# EAGLE schematic BonkSwitch (EAGLE 7.7.0)
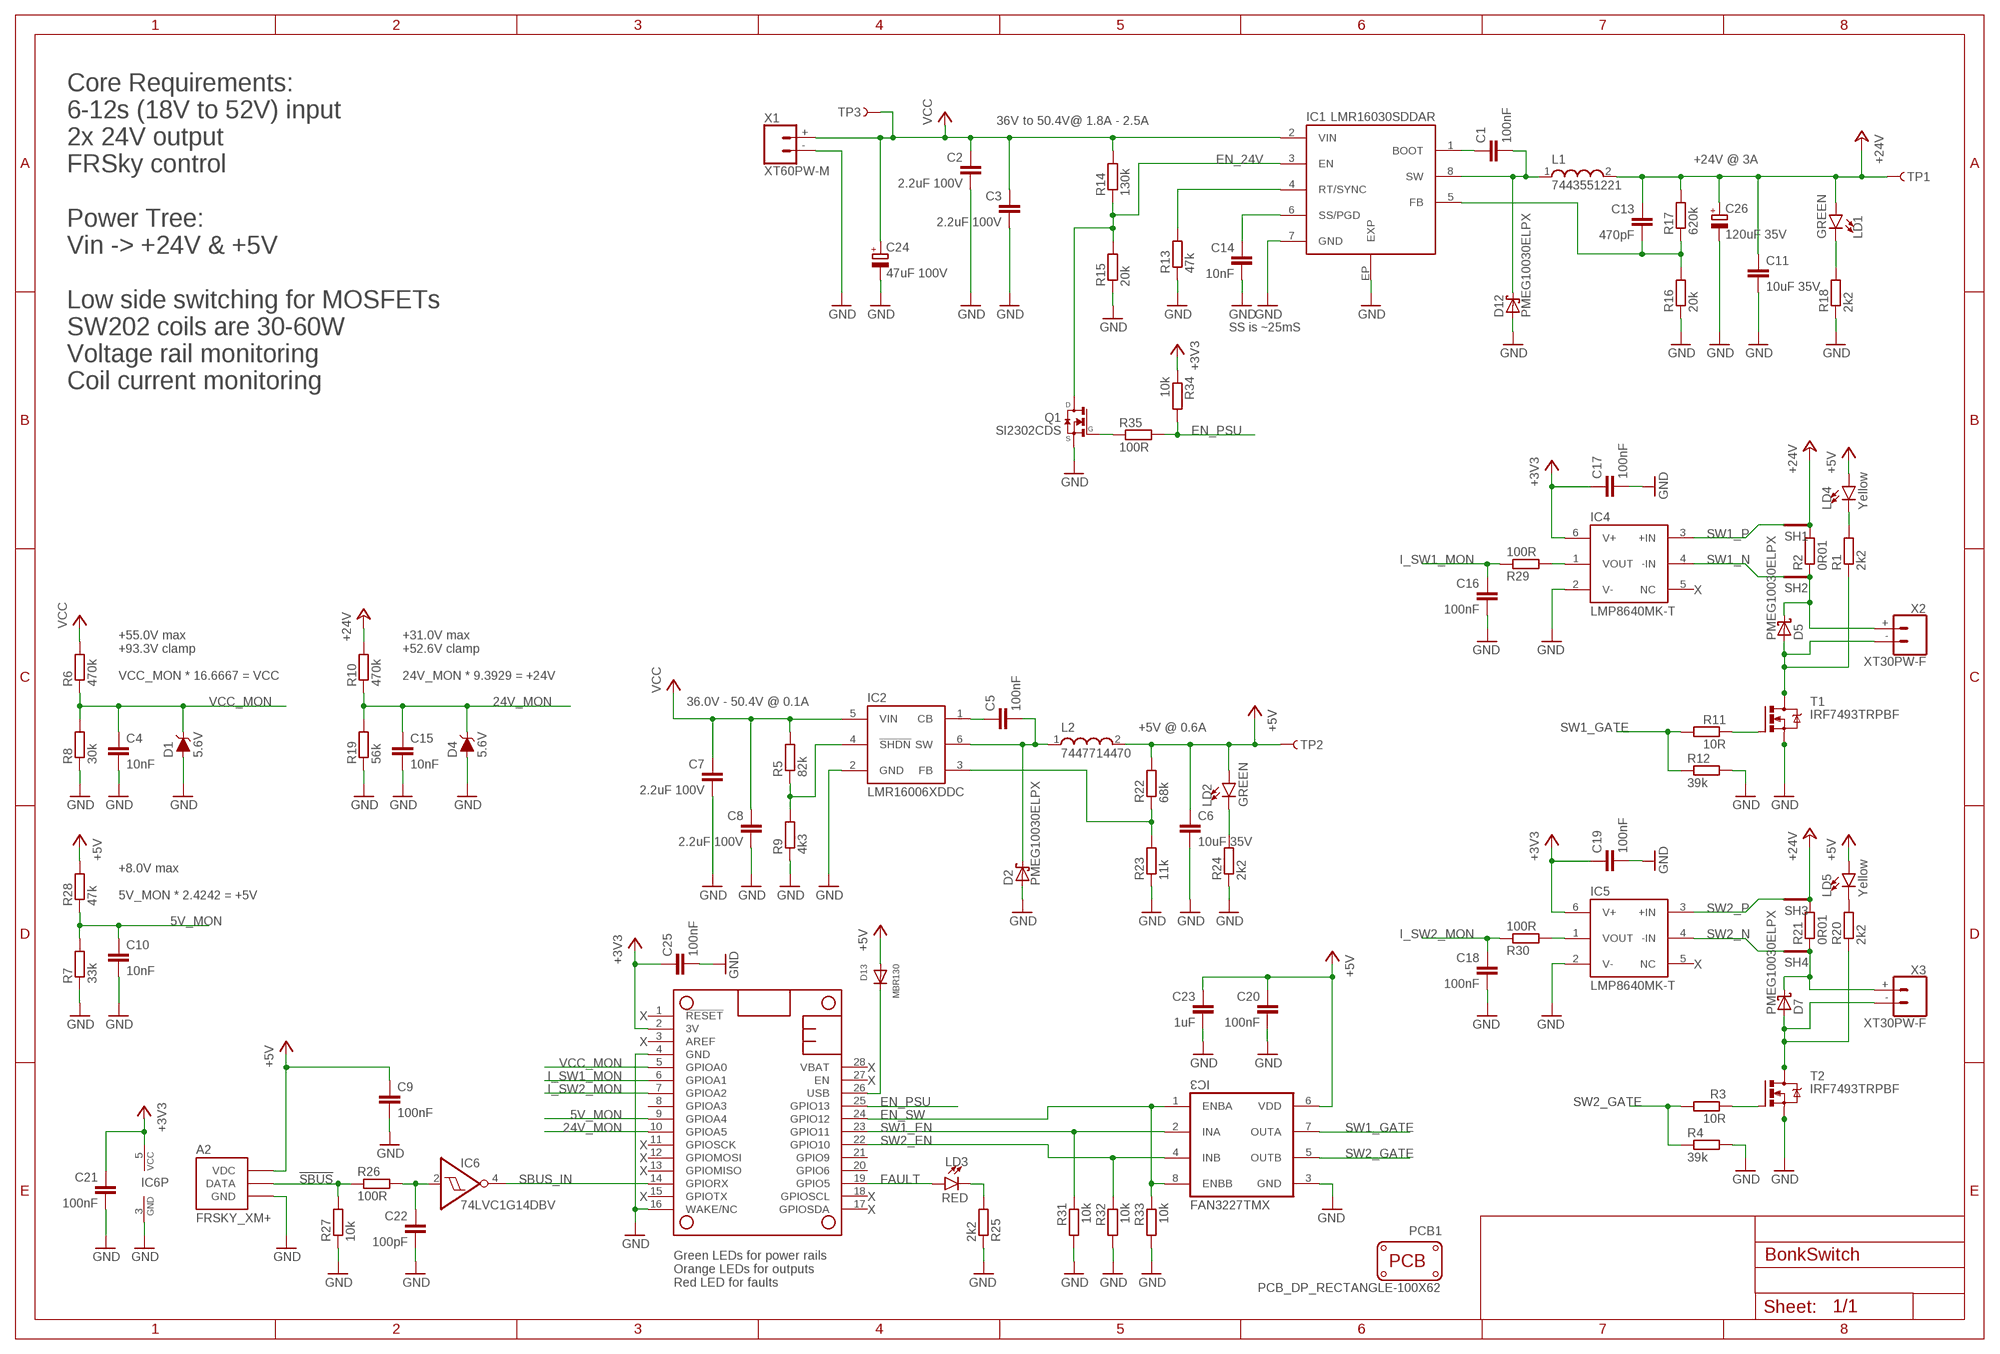
[diagram p0: schematic, sheet 1]

## Parts
A1  FEATHERWING_NODIM  [FEATHERWING_DIM]
A2  FRSKY_XM+  [FRSKY_XM+]
C1  100nF  C-EUC0603  [C0603]
C2  2.2uF 100V  C-EUC1210  [C1210]
C3  2.2uF 100V  C-EUC1210  [C1210]
C4  10nF  C-EUC0603  [C0603]
C5  100nF  C-EUC0603  [C0603]
C6  10uF 35V  C-EUC1210  [C1210]
C7  2.2uF 100V  C-EUC1210  [C1210]
C8  2.2uF 100V  C-EUC1210  [C1210]
C9  100nF  C-EUC0603  [C0603]
C10  10nF  C-EUC0603  [C0603]
C11  10uF 35V  C-EUC1210  [C1210]
C13  470pF  C-EUC0603  [C0603]
C14  10nF  C-EUC0603  [C0603]
C15  10nF  C-EUC0603  [C0603]
C16  100nF  C-EUC0603  [C0603]
C17  100nF  C-EUC0603  [C0603]
C18  100nF  C-EUC0603  [C0603]
C19  100nF  C-EUC0603  [C0603]
C20  100nF  C-EUC0603  [C0603]
C21  100nF  C-EUC0603  [C0603]
C22  100pF  C-EUC0603  [C0603]
C23  1uF  C-EUC0805  [C0805]
C24  47uF 100V  CPOL-EUUD-10X10  [UD-10X10_NICHICON]
C25  100nF  C-EUC0603  [C0603]
C26  120uF 35V  CPOL-EUE  [PANASONIC_E]
D1  5.6V  DIODE-ZENER-MMSZ5232BS  [SOD-323]
D2  PMEG10030ELPX  SCHOTTKY-DIODESOD128  [SOD128]
D4  5.6V  DIODE-ZENER-MMSZ5232BS  [SOD-323]
D5  PMEG10030ELPX  SCHOTTKY-DIODESOD128  [SOD128]
D7  PMEG10030ELPX  SCHOTTKY-DIODESOD128  [SOD128]
D12  PMEG10030ELPX  SCHOTTKY-DIODESOD128  [SOD128]
D13  MBR130  DIODESOD-123  [SOD-123]
IC1  LMR16030SDDAR  LMR16030  [HSOIC8]
IC2  LMR16006XDDC  LMR16006  [SOT23-6]
IC3  FAN3227TMX  UCC27424D  [SOIC127P600X175-8N]
IC4  LMP8640MK-T  LMP8640  [SOT23-6]
IC5  LMP8640MK-T  LMP8640  [SOT23-6]
IC6  74LVC1G14DBV  74AHC1G14DBV  [SOT23-5]
L1  7443551221  WE-HCI_1350/1365  [WE-HCI_1350/1365]
L2  7447714470  WE-PD_1030/1050  [WE-PD_1030/1050]
LD1  GREEN  LED-GREEN0603  [LED-0603]
LD2  GREEN  LED-GREEN0603  [LED-0603]
LD3  RED  LED-RED0603  [LED-0603]
LD4  Yellow  LED-YELLOW0603  [LED-0603]
LD5  Yellow  LED-YELLOW0603  [LED-0603]
PCB1  PCB_DP_RECTANGLE-100X62  [DP10062_V1]
Q1  SI2302CDS  SI2302  [SOT23]
R1  2k2  R-EU_R0603  [R0603]
R2  0R01  R-EU_R2512  [R2512]
R3  10R  R-EU_R0805  [R0805]
R4  39k  R-EU_R0805  [R0805]
R5  82k  R-EU_R0603  [R0603]
R6  470k  R-EU_R0603  [R0603]
R7  33k  R-EU_R0603  [R0603]
R8  30k  R-EU_R0603  [R0603]
R9  4k3  R-EU_R0603  [R0603]
R10  470k  R-EU_R0603  [R0603]
R11  10R  R-EU_R0805  [R0805]
R12  39k  R-EU_R0805  [R0805]
R13  47k  R-EU_R0603  [R0603]
R14  130k  R-EU_R0603  [R0603]
R15  20k  R-EU_R0603  [R0603]
R16  20k  R-EU_R0603  [R0603]
R17  620k  R-EU_R0603  [R0603]
R18  2k2  R-EU_R0805  [R0805]
R19  56k  R-EU_R0603  [R0603]
R20  2k2  R-EU_R0603  [R0603]
R21  0R01  R-EU_R2512  [R2512]
R22  68k  R-EU_R0603  [R0603]
R23  11k  R-EU_R0603  [R0603]
R24  2k2  R-EU_R0603  [R0603]
R25  2k2  R-EU_R0603  [R0603]
R26  100R  R-EU_R0603  [R0603]
R27  10k  R-EU_R0603  [R0603]
R28  47k  R-EU_R0603  [R0603]
R29  100R  R-EU_R0603  [R0603]
R30  100R  R-EU_R0603  [R0603]
R31  10k  R-EU_R0603  [R0603]
R32  10k  R-EU_R0603  [R0603]
R33  10k  R-EU_R0603  [R0603]
R34  10k  R-EU_R0603  [R0603]
R35  100R  R-EU_R0603  [R0603]
SH1  SHORTT1  [SHORT_TOP-01]
SH2  SHORTT1  [SHORT_TOP-01]
SH3  SHORTT1  [SHORT_TOP-01]
SH4  SHORTT1  [SHORT_TOP-01]
T1  IRF7493TRPBF  N-MOSFET-SO8S  [SO-08]
T2  IRF7493TRPBF  N-MOSFET-SO8S  [SO-08]
TP1  TESTPOINT_1.5X1.5  [TESTPAD_1.5X1.5]
TP2  TESTPOINT_1.5X1.5  [TESTPAD_1.5X1.5]
TP3  TESTPOINT_1.5X1.5  [TESTPAD_1.5X1.5]
X1  XT60PW-M  [XT60PW-M]
X2  XT30PW-F  [XT30PW-F]
X3  XT30PW-F  [XT30PW-F]

## Nets
5V_MON: A1.9(GPIOA4) C10.1 R7.2 R28.1
24V_MON: A1.10(GPIOA5) C15.1 D4.C R10.1 R19.2
!SBUS: A2.3(DATA) R26.1 R27.2
!SBUS_FILT: C22.1 IC6.2(I) R26.2
+3V3: A1.2(3V) C17.1 C19.1 C21.1 C25.1 IC4.6(V+) IC5.6(V+) IC6.5(VCC) R34.1
+5V: A2.2(VDC) C6.1 C9.1 C20.1 C23.1 D13.A IC3.6(VDD) L2.2 LD2.A LD4.A LD5.A R22.2 R28.2 TP2.1
+24V [power]: C11.1 C13.1 C26.+ L1.2 LD1.A R2.2 R10.2 R17.2 R21.2 SH1.1 SH3.1 TP1.1
BST_5V: C5.1 IC2.1(CB)
BST_24V: C1.1 IC1.1(BOOT)
EN_5V: IC2.4(!SHDN!) R5.1 R9.2
EN_24V: IC1.3(EN) Q1.3(D) R14.1 R15.2
EN_PSU: A1.25(GPIO13) R34.2 R35.2
EN_SW: A1.24(GPIO12) IC3.1(ENBA) IC3.8(ENBB) R33.1
FAULT: A1.19(GPIO5) LD3.A
FB_5V: IC2.3(FB) R22.1 R23.2
FB_24V: C13.2 IC1.5(FB) R16.2 R17.1
GND: A1.4(GND) A1.16(WAKE/NC) A2.1(GND) C2.2 C3.2 C4.2 C6.2 C7.2 C8.2 C9.2 C10.2 C11.2 C14.2 C15.2 C16.2 C17.2 C18.2 C19.2 C20.2 C21.2 C22.2 C23.2 C24.- C25.2 C26.- D1.A D2.A D4.A D12.A IC1.7(GND) IC1.EP(EXP) IC2.2(GND) IC3.3(GND) IC4.2(V-) IC5.2(V-) IC6.3(GND) Q1.2(S) R4.2 R7.1 R8.1 R9.1 R12.2 R13.1 R15.1 R16.1 R18.1 R19.1 R23.1 R24.1 R25.1 R27.1 R31.2 R32.2 R33.2 T1.1(S) T1.2(S) T1.3(S) T2.1(S) T2.2(S) T2.3(S) X1.-
I_SW1: IC4.1(VOUT) R29.2
I_SW1_MON: A1.6(GPIOA1) C16.1 R29.1
I_SW2: IC5.1(VOUT) R30.2
I_SW2_MON: A1.7(GPIOA2) C18.1 R30.1
N$1 [power]: D7.C R21.1 SH4.1 X3.+
N$2: Q1.1(G) R35.1
N$3: R11.1 T1.4(G)
N$4 [power]: D5.A R1.1 T1.5(D) T1.6(D) T1.7(D) T1.8(D) X2.-
N$6: LD4.C R1.2
N$9: R3.1 T2.4(G)
N$10 [power]: D7.A R20.1 T2.5(D) T2.6(D) T2.7(D) T2.8(D) X3.-
N$11: LD5.C R20.2
N$12 [power]: D5.C R2.1 SH2.1 X2.+
N$13: LD3.C R25.2
N$14: LD1.C R18.2
N$19: LD2.C R24.2
RT_24V: IC1.4(RT/SYNC) R13.2
SBUS_IN: A1.14(GPIORX) IC6.4(O)
SS_24V: C14.1 IC1.6(SS/PGD)
SW1_EN: A1.23(GPIO11) IC3.2(INA) R31.1
SW1_GATE: IC3.7(OUTA) R11.2 R12.1
SW1_N: IC4.4(-IN) SH2.2
SW1_P: IC4.3(+IN) SH1.2
SW2_EN: A1.22(GPIO10) IC3.4(INB) R32.1
SW2_GATE: IC3.5(OUTB) R3.2 R4.1
SW2_N: IC5.4(-IN) SH4.2
SW2_P: IC5.3(+IN) SH3.2
SW_5V: C5.2 D2.C IC2.6(SW) L2.1
SW_24V [power]: C1.2 D12.C IC1.8(SW) L1.1
V_USB: A1.26(USB) D13.C
VCC [power]: C2.1 C3.1 C7.1 C8.1 C24.+ IC1.2(VIN) IC2.5(VIN) R5.2 R6.2 R14.2 TP3.1 X1.+
VCC_MON: A1.5(GPIOA0) C4.1 D1.C R6.1 R8.2
Unconnected: A1.1(!RESET) A1.3(AREF) A1.8(GPIOA3) A1.11(GPIOSCK) A1.12(GPIOMOSI) A1.13(GPIOMISO) A1.15(GPIOTX) A1.17(GPIOSDA) A1.18(GPIOSCL) A1.20(GPIO6) A1.21(GPIO9) A1.27(EN) A1.28(VBAT) IC4.5(NC) IC5.5(NC)

## Notes on the sheet
- Core Requirements:
  6-12s (18V to 52V) input
  2x 24V output
  FRSky control
  
  Power Tree:
  Vin -> +24V & +5V
  
  Low side switching for MOSFETs
  SW202 coils are 30-60W
  Voltage rail monitoring
  Coil current monitoring
- 36V to 50.4V@ 1.8A - 2.5A
- +24V @ 3A
- SS is ~25mS
- X
- +55.0V max
  +93.3V clamp
  
  VCC_MON * 16.6667 = VCC
- +31.0V max
  +52.6V clamp
  
  24V_MON * 9.3929 = +24V
- 36.0V - 50.4V @ 0.1A
- +5V @ 0.6A
- +8.0V max
  
  5V_MON * 2.4242 = +5V
- X
- X
- X
- X
- X
- X
- X
- X
- X | X
- X
- Green LEDs for power rails
  Orange LEDs for outputs
  Red LED for faults

## Library data of the parts
A1 = ThingySticks:FEATHERWING; OC_FARNELL: unknown
A2 = general:FRSKY_XM+; OC_FARNELL: unknown
C1 C4 C5 C9 C10 C13-C23 C25 = rcl:C-EU: CAPACITOR, European symbol; OC_FARNELL: unknown
C2 C3 C7 C8 = rcl:C-EU: CAPACITOR, European symbol; MF: TDK; MPN: C3225X7R2A225K230AB; OC_FARNELL: 2112727; OC_RS: 766-1211
C6 C11 = rcl:C-EU: CAPACITOR, European symbol; MF: TAIYO YUDEN; MPN: GMK325AB7106MM-T; OC_FARNELL: 2309017; OC_RS: 766-1194
C24 = rcl:CPOL-EU: POLARIZED CAPACITOR, European symbol; MF: PANASONIC; MPN: EEEHA2A470UP; OC_FARNELL: 1973389; OC_RS: 739-3116
C26 = rcl:CPOL-EU: POLARIZED CAPACITOR, European symbol; MF: PANASONIC; MPN: 35SVPF120M; OC_FARNELL: 2354806; OC_RS: 795-5348
D1 D4 = SparkFun-DiscreteSemi:DIODE-ZENER: Zener Diode A Zener diode allows current to flow from its anode to its cathode like a normal semiconductor diode, but it also permits current to flow in the reverse direction when its "Zener voltage" is reached. - WIkipedia; MF: ON SEMICONDUCTOR; MPN: MM3Z4V3ST1G; OC_FARNELL: 2844819; OC_RS: 802-4625; PROD_ID: DIO-12442
D2 D5 D7 D12 = diode:SCHOTTKY-DIODE: Schottky Diode; MF: NEXPERIA; MPN: PMEG10030ELPX; OC_FARNELL: 2498548
D13 = microbuilder:DIODE: Diode SMADIODE - SMA Surface Mount Package 20V 1A Schottky Diode Digikey (500mV @ 1A, 500uA Vr @ 20V): 641-1014-6-ND 10V 2A Schottky Diode Digikey (350mV @ 2A, 700uA Vr @ 10V): MBRA210LT3 SOD-123 30V 200mA (800mV Vf, 2uA Vr @ 25V) Schottky Diode (very fast switching for boost, etc.) - Digikey: BAT54T1GOSTR-ND 30V 500mA (430mV Vf, 130uA Vr @ 30V) Schottky Diode - Digikey: B0530W-FDICT-ND MBR120 1A 20V (0.34Vf) Schottky Diode - Digikey: MBR120VLSFT1GOSCT-ND SOD-323 10V 570mA (380mV Vf, 3ns) Schottky Diode - Digikey: ZLLS410CT-ND 1N4148WS - 75V 150mA (1V Vf @ 10mA, 4ns) Simple Diode - Digikey: 1N4148WSFSCT-ND, Mouser: 512-1N4148WS SOD-523 BAT54 30V 200mA Schottky (0.8 Vf @ 100mA, 5ns) - Digikey: BAT54XV2CT-ND 30V 30mA Schottky Diode (RB751S-40TE61) - Digikey: RB751S-40TE61CT-ND SOT23-R/W - SOT23 Package (R = Solder Paste/Reflow Ovens, W = Hand-Soldering) BAT54Film 40V 300mA - Digikey: 497-7162-1-ND DO-1N4148 Through Hole Small Current Diode (any model); MF: ON SEMICONDUCTOR; MPN: MBR130LSFT1G; OC_FARNELL: 2463407; OC_RS: 773-7715
IC1 = general:LMR16030; MF: TEXAS INSTRUMENTS; MPN: LMR16030SDDA .; OC_FARNELL: 2617078
IC2 = general:LMR16006: The LMR16006 is a PWM DC/DC buck (step-down) regulator. With a wide input range of 4 V to 60 V, it is suitable for a wide range of application from industrial to automotive for power conditioning from an unregulated source. The regulator’s standby current is 28 µA in ECO mode, which is suitable for battery operating systems. An ultra low 1 µA shutdown current can further prolong battery life. Operating frequency is fixed at 0.7 MHz (X version) and 2.1 MHz (Y version) allowing the use of small external components while still being able to have low output ripple voltage. Soft-start and compensation circuits are implemented internally, which allows the device to be used with minimized external components. The LMR16006 is optimized for up to 600 mA load currents. It has a 0.765 V typical feedback voltage. The device has built-in protection features such as pulse by pulse current limit, thermal sensing and shutdown due to excessive power dissipation. The LMR16006 is available in a low profile SOT-6L package.; MF: TEXAS INSTRUMENTS; MPN: LMR16006XDDCR; OC_FARNELL: 3007251; OC_RS: 914-2986
IC3 = Texas Instruments_By_element14_Batch_1:UCC27424D: DUAL 4-A HIGH SPEED LOW-SIDE MOSFET DRIVERS WITH ENABLE; MF: ON SEMICONDUCTOR; MPN: FAN3227TMX; OC_FARNELL: 2563218; OC_NEWARK: 87H4671; PACKAGE: SOIC-8; SUPPLIER: Texas Instruments
IC4 IC5 = general:LMP8640; MF: TEXAS INSTRUMENTS; MPN: LMP8640MK-T/NOPB; OC_FARNELL: 3005385; OC_RS: 824-7083
IC6 = 74xx-little-de:74*1G14: Single Schmitt-Trigger Inverter Gate; MF: NEXPERIA; MPN: 74LVC1G14GW,125; OC_FARNELL: 1631687
L1 = WE-PD2:WE-HCI: SMD Flat Wire High Current Inductor Characteristics Magnetically shielded Flat wire coil for low losses at high frequency Low stray field Operating temperature: –40 °C to +150/155 °C Applications Graphic cards Laptops Industrial computers Motherboards High current switching regulators DC/DC converter Polyphase-switching regulators Filter <http://katalog.we-online.de/media/images/v2/Family_WE-HCI.jpg> Details see: http://katalog.we-online.de/en/pbs/WE-HCI? Updated by Dan Xu 2014-07-07 2014 (C) Wurth Elektronik; MF: WURTH ELEKTRONIK; MPN: 7443551221; OC_FARNELL: 2082647
L2 = WE-PD2:WE-PD: SMD Shielded Power Inductor Characteristics Magnetically shielded version which results in a low leakage field High Saturation currents up to 25 A Very low self-losses at high switching frequency‘s Wide inductances spectrum available at all sizes Operating temperature: –40 °C to +125 °C Applications Perfectly suitable for switching regulators with extremely high efficiency Integrated DC/DC- converter Switching regulators with low operating voltages (Graphic cards, embedded PC-Cards, Mainboards) Plastic base: Because of the one piece construction these are more suitable for high vibration or shock applications <http://katalog.we-online.de/media/images/v2/Family_WE-PD.jpg> Details see: http://katalog.we-online.de/en/pbs/WE-PD? Updated by Dan Xu 2014-07-08 2014 (C) Wurth Elektronik; MF: WURTH ELEKTRONIK; MPN: 7447714470; OC_FARNELL: 2082682; OC_RS: 789-6987
LD1 LD2 = SparkFun-LED:LED-GREEN: Green SMD LED Used in manufacturing of various products at SparkFun Packages: 0603 - SMD 0603 package [Product Link] <http://www.futureelectronics.com/en/technologies/semiconductors/optoelectronics/leds/Pages/9894312-LTST-C190GKT.aspx?CrossPart=HSMG-C190&IM=0> LilyPad 1206 - SMD1206 LilyPad package [Product Link] <http://www.futureelectronics.com/en/Technologies/Product.aspx?ProductID=IN150NGHARVATEKCORPORATION2049943&IM=0> 1206 - SMD1206 package [Product Link] <http://www.futureelectronics.com/en/technologies/semiconductors/optoelectronics/leds/Pages/8315665-LTST-C150KGKT.aspx?IM=0> 1206 Bottom Mount -SMD 1206 Bottom Mount [Product Link] <http://www.digikey.com/product-detail/en/lite-on-inc/LTST-C230KGKT/160-1456-1-ND/386854> SparkFun Products: Pro Mini 328 -5V <https://www.sparkfun.com/products/821> RedBoard <https://www.sparkfun.com/products/12757> MP3 Trigger <https://www.sparkfun.com/products/13720> Makey Makey <https://www.sparkfun.com/products/11076>; OC_FARNELL: unknown; PROD_ID: DIO-00821
LD3 = SparkFun-LED:LED-RED: Red SMD LED Used in manufacturing of most products at SparkFun Packages: 0603 - SMD 0603 package [Product Link] <http://docs.avagotech.com/docs/AV02-0551EN> 0603 SMART - SMD 0603 SMART package ( more efficient and expensive)[Product Link] <http://www.osram-os.com/Graphics/XPic2/00077099_0.pdf> 1206 - SMD1206 package [Product Link] <https://www.sparkfun.com/datasheets/DevTools/LilyPad/Q150OVS4.pdff> SparkFun Products: Pro Mini 328 -5V <https://www.sparkfun.com/products/821> RedBoard <https://www.sparkfun.com/products/12757> IOIO-OTG <https://www.sparkfun.com/products/13613>; OC_FARNELL: unknown; PROD_ID: DIO-00819
LD4 LD5 = SparkFun-LED:LED-YELLOW: Yellow SMD LED Used in manufacturing several products at SparkFun. Packages: 0603 - SMD 0603 package[Product Link] <http://www.kingbrightusa.com/product.asp?catalog_name=LED&product_id=APT1608SYCK> 0603 -SMART - SMART SMD 0603 package (more efficient/more expensive) [Product Link] <http://www.osram-os.com/osram_os/en/products/product-catalog/led-light-emitting-diodes/smartled-0603/ly-l29k/index.jsp> LilyPad - SMD1206 package[Product Datasheet] <https://www.sparkfun.com/datasheets/DevTools/LilyPad/Q150YUS4.pdf> SparkFun Products: Blynk Board <https://www.sparkfun.com/products/13794> IOIO-OTG <https://www.sparkfun.com/products/13613> XBee Explorer Serial <https://www.sparkfun.com/products/13225>; OC_FARNELL: unknown; PROD_ID: DIO-09003
PCB1 = dp_devices:PCB_DP_RECTANGLE: Dangerous Prototypes Standard Rectangular PCB sizes; OC_FARNELL: unknown
Q1 = transistor-fet:SI2302: MOSFET N-Channel 20 V (D-S); MF: VISHAY; MPN: SI2302CDS-T1-GE3; OC_FARNELL: 1684049
R1 R3-R20 R22-R35 = rcl:R-EU_: RESISTOR, European symbol; OC_FARNELL: unknown
R2 R21 = rcl:R-EU_: RESISTOR, European symbol; MF: BOURNS; MPN: CRA2512-FZ-R010ELF; OC_FARNELL: 1435947; OC_RS: 693-4381
SH1-SH4 = shorts:SHORT: Short between two nets; OC_FARNELL: unknown
T1 T2 = transistor-power:N-MOSFET-SO8: N-Channel MOSFET Example: FDS7760A; N-Channel Logic Level PowerTrench® MOSFET FDS2572; N-Channel UltraFET® Trench MOSFET Source: www.fairchildsemi.com; MF: INFINEON; MPN: IRF7493TRPBF; OC_FARNELL: 2725911
TP1-TP3 = general:TESTPOINT; OC_FARNELL: unknown
X1 = con-amass:XT60; OC_FARNELL: unknown
X2 X3 = con-amass:XT30; OC_FARNELL: unknown

## Net classes
0 default: width 0.152 mm, drill 0.33 mm
1 power: width 0.508 mm, drill 0.33 mm, clearance 0.305 mm